# EAGLE board panel (EAGLE 8.7.0), part 1 of 2
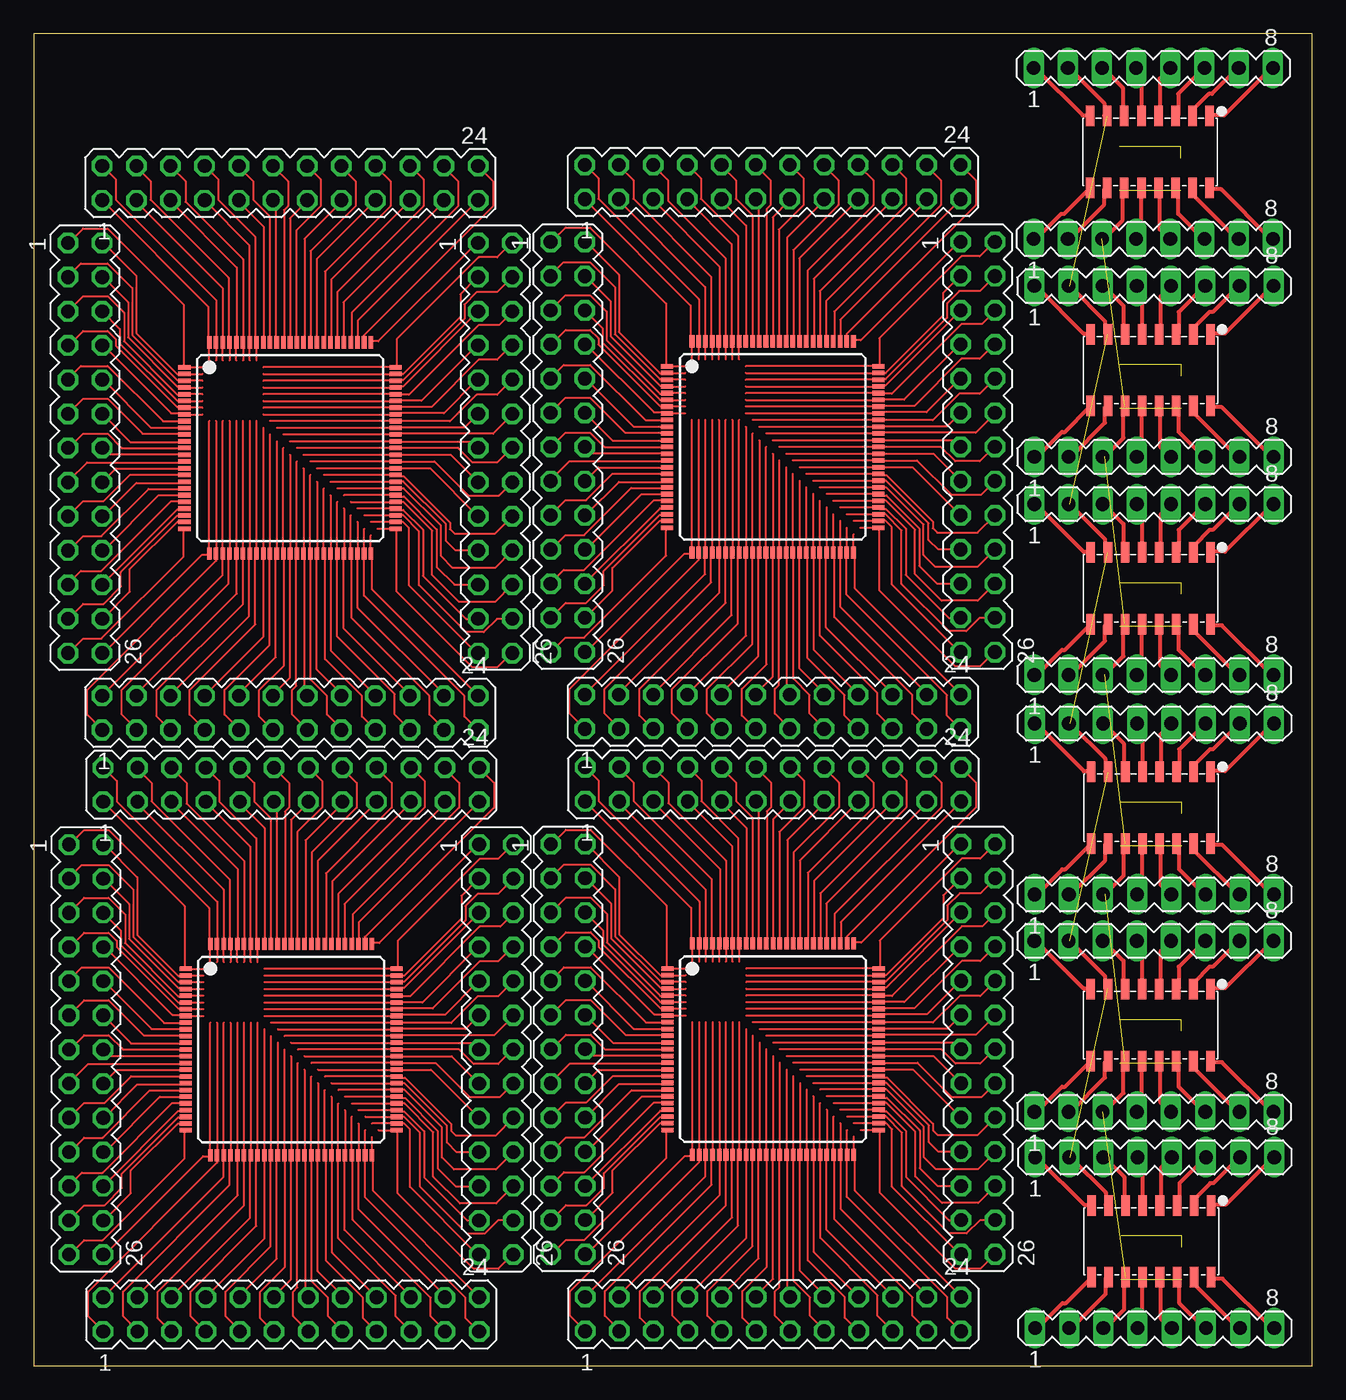
[diagram p5: board, top side]
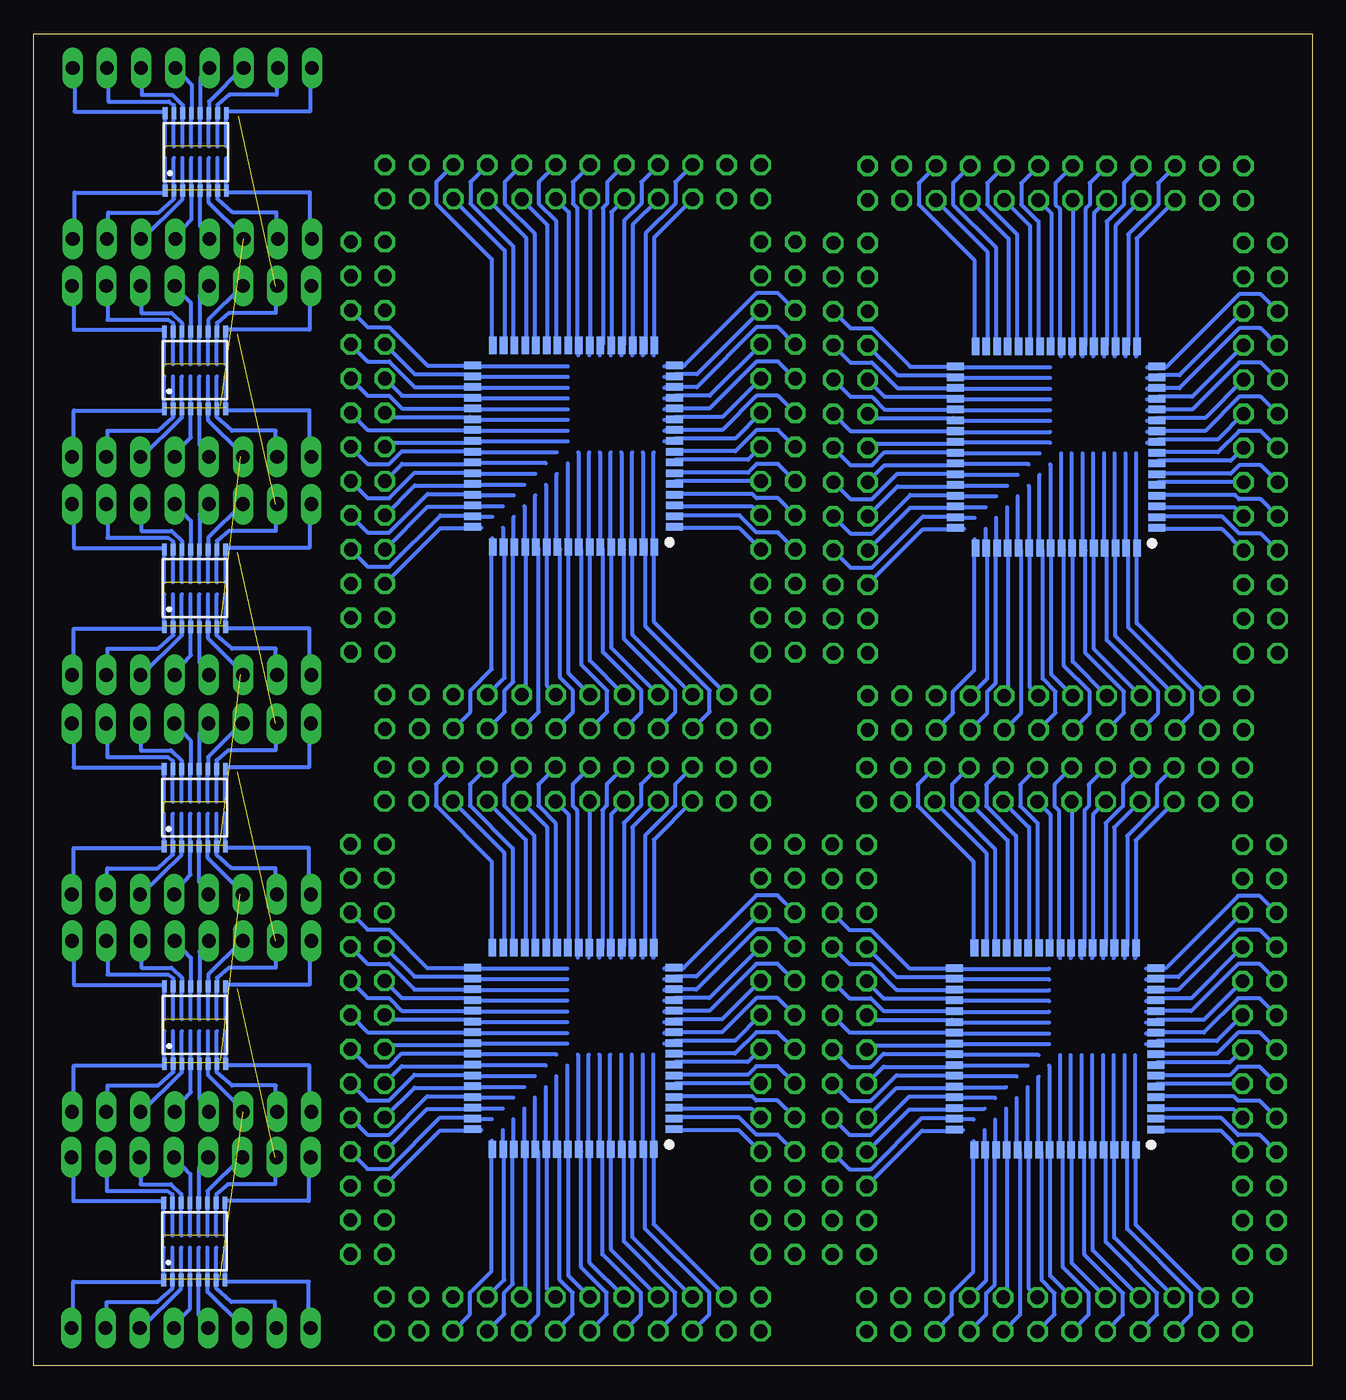
[diagram p6: board, bottom side, seen from below]

Size 95 x 99 mm. Coordinates in mm from the lower left corner, seen from the top.
Outline: 0,0 95,0 95,99 0,99 0,0
Copper layers (1*16): Top 0.035mm / dielectric 1.5mm / Bottom 0.035mm
Design rules "default": minimum track width 6mil, minimum drill 0.35mm, track to track 6mil, track to pad 6mil, pad to pad 6mil, via to via 6mil, smd to smd 6mil, copper to edge 40mil, drill to drill 6mil, minimum pad ring 10mil, minimum via ring 8mil, stop-mask expansion 4mil, vias tented up to drill 0mil, thermal gap 10mil

## Footprints (pad centres in the part's own frame; a part is rotated, then mirrored left to right if it is on the bottom)
TQFP100-14X14 = smd 0.9 x 0.34: 1 -7.85,6; 2 -7.85,5.5; 3 -7.85,5; 4 -7.85,4.5; 5 -7.85,4; 6 -7.85,3.5; 7 -7.85,3; 8 -7.85,2.5; 9 -7.85,2; 10 -7.85,1.5; 11 -7.85,1; 12 -7.85,0.5; 13 -7.85,0; 14 -7.85,-0.5; 15 -7.85,-1; 16 -7.85,-1.5; 17 -7.85,-2; 18 -7.85,-2.5; 19 -7.85,-3; 20 -7.85,-3.5; 21 -7.85,-4; 22 -7.85,-4.5; 23 -7.85,-5; 24 -7.85,-5.5; 25 -7.85,-6; 51 7.85,-6; 52 7.85,-5.5; 53 7.85,-5; 54 7.85,-4.5; 55 7.85,-4; 56 7.85,-3.5; 57 7.85,-3; 58 7.85,-2.5; 59 7.85,-2; 60 7.85,-1.5; 61 7.85,-1; 62 7.85,-0.5; 63 7.85,0; 64 7.85,0.5; 65 7.85,1; 66 7.85,1.5; 67 7.85,2; 68 7.85,2.5; 69 7.85,3; 70 7.85,3.5; 71 7.85,4; 72 7.85,4.5; 73 7.85,5; 74 7.85,5.5; 75 7.85,6 | smd 0.34 x 0.9: 26 -6,-7.85; 27 -5.5,-7.85; 28 -5,-7.85; 29 -4.5,-7.85; 30 -4,-7.85; 31 -3.5,-7.85; 32 -3,-7.85; 33 -2.5,-7.85; 34 -2,-7.85; 35 -1.5,-7.85; 36 -1,-7.85; 37 -0.5,-7.85; 38 0,-7.85; 39 0.5,-7.85; 40 1,-7.85; 41 1.5,-7.85; 42 2,-7.85; 43 2.5,-7.85; 44 3,-7.85; 45 3.5,-7.85; 46 4,-7.85; 47 4.5,-7.85; 48 5,-7.85; 49 5.5,-7.85; 50 6,-7.85; 76 6,7.85; 77 5.5,7.85; 78 5,7.85; 79 4.5,7.85; 80 4,7.85; 81 3.5,7.85; 82 3,7.85; 83 2.5,7.85; 84 2,7.85; 85 1.5,7.85; 86 1,7.85; 87 0.5,7.85; 88 0,7.85; 89 -0.5,7.85; 90 -1,7.85; 91 -1.5,7.85; 92 -2,7.85; 93 -2.5,7.85; 94 -3,7.85; 95 -3.5,7.85; 96 -4,7.85; 97 -4.5,7.85; 98 -5,7.85; 99 -5.5,7.85; 100 -6,7.85
MA13-2 = drill 1.016 octagon: 1 -15.24,-1.27; 2 -15.24,1.27; 3 -12.7,-1.27; 4 -12.7,1.27; 5 -10.16,-1.27; 6 -10.16,1.27; 7 -7.62,-1.27; 8 -7.62,1.27; 9 -5.08,-1.27; 10 -5.08,1.27; 11 -2.54,-1.27; 12 -2.54,1.27; 13 0,-1.27; 14 0,1.27; 15 2.54,-1.27; 16 2.54,1.27; 17 5.08,-1.27; 18 5.08,1.27; 19 7.62,-1.27; 20 7.62,1.27; 21 10.16,-1.27; 22 10.16,1.27; 23 12.7,-1.27; 24 12.7,1.27; 25 15.24,-1.27; 26 15.24,1.27
MA12-2 = drill 1.016 octagon: 1 -13.97,-1.27; 2 -13.97,1.27; 3 -11.43,-1.27; 4 -11.43,1.27; 5 -8.89,-1.27; 6 -8.89,1.27; 7 -6.35,-1.27; 8 -6.35,1.27; 9 -3.81,-1.27; 10 -3.81,1.27; 11 -1.27,-1.27; 12 -1.27,1.27; 13 1.27,-1.27; 14 1.27,1.27; 15 3.81,-1.27; 16 3.81,1.27; 17 6.35,-1.27; 18 6.35,1.27; 19 8.89,-1.27; 20 8.89,1.27; 21 11.43,-1.27; 22 11.43,1.27; 23 13.97,-1.27; 24 13.97,1.27
MA08-1 = drill 1.016 long: 1 -8.89,0; 2 -6.35,0; 3 -3.81,0; 4 -1.27,0; 5 1.27,0; 6 3.81,0; 7 6.35,0; 8 8.89,0
SOP16-1.27-10.0X5.0MM = smd 0.635 x 1.524: 1 -4.445,-2.667; 2 -3.175,-2.667; 3 -1.905,-2.667; 4 -0.635,-2.667; 5 0.635,-2.667; 6 1.905,-2.667; 7 3.175,-2.667; 8 4.445,-2.667; 9 4.445,2.667; 10 3.175,2.667; 11 1.905,2.667; 12 0.635,2.667; 13 -0.635,2.667; 14 -1.905,2.667; 15 -3.175,2.667; 16 -4.445,2.667
TQFP64-0.8 = smd 1.27 x 0.559: 1 -4.293,2.8; 2 -4.293,2; 3 -4.293,1.2; 4 -4.293,0.4; 5 -4.293,-0.4; 6 -4.293,-1.2; 7 -4.293,-2; 8 -4.293,-2.8; 9 -4.293,-3.6; 10 -4.293,-4.4; 11 -4.293,-5.2; 12 -4.293,-6; 13 -4.293,-6.8; 14 -4.293,-7.6; 15 -4.293,-8.4; 16 -4.293,-9.2; 33 10.693,-9.2; 34 10.693,-8.4; 35 10.693,-7.6; 36 10.693,-6.8; 37 10.693,-6; 38 10.693,-5.2; 39 10.693,-4.4; 40 10.693,-3.6; 41 10.693,-2.8; 42 10.693,-2; 43 10.693,-1.2; 44 10.693,-0.4; 45 10.693,0.4; 46 10.693,1.2; 47 10.693,2; 48 10.693,2.8 | smd 0.559 x 1.27: 17 -2.8,-10.693; 18 -2,-10.693; 19 -1.2,-10.693; 20 -0.4,-10.693; 21 0.4,-10.693; 22 1.2,-10.693; 23 2,-10.693; 24 2.8,-10.693; 25 3.6,-10.693; 26 4.4,-10.693; 27 5.2,-10.693; 28 6,-10.693; 29 6.8,-10.693; 30 7.6,-10.693; 31 8.4,-10.693; 32 9.2,-10.693; 49 9.2,4.293; 50 8.4,4.293; 51 7.6,4.293; 52 6.8,4.293; 53 6,4.293; 54 5.2,4.293; 55 4.4,4.293; 56 3.6,4.293; 57 2.8,4.293; 58 2,4.293; 59 1.2,4.293; 60 0.4,4.293; 61 -0.4,4.293; 62 -1.2,4.293; 63 -2,4.293; 64 -2.8,4.293
TSSOP16 = smd 0.9 x 0.35: 1 -2.875,2.275; 2 -2.875,1.625; 3 -2.875,0.975; 4 -2.875,0.325; 5 -2.875,-0.325; 6 -2.875,-0.975; 7 -2.875,-1.625; 8 -2.875,-2.275; 9 2.875,-2.275; 10 2.875,-1.625; 11 2.875,-0.975; 12 2.875,-0.325; 13 2.875,0.325; 14 2.875,0.975; 15 2.875,1.625; 16 2.875,2.275

## Placement (x,y rotation side)
IC2  [TQFP100-14X14]  19.14,23.5 0 top
IC3  [TQFP100-14X14]  54.92,68.28 0 top
IC4  [TQFP100-14X14]  54.95,23.53 0 top
IC6  [TQFP100-14X14]  19.06,68.21 0 top
JP5  [MA13-2]  3.9,23.5 270 top
JP6  [MA13-2]  34.38,23.5 270 top
JP7  [MA12-2]  19.14,43.19 0 top
JP8  [MA12-2]  19.14,3.82 0 top
JP9  [MA13-2]  39.68,68.28 270 top
JP10  [MA13-2]  70.16,68.28 270 top
JP11  [MA12-2]  54.92,87.97 0 top
JP12  [MA12-2]  54.92,48.6 0 top
JP13  [MA13-2]  39.71,23.53 270 top
JP14  [MA13-2]  70.19,23.53 270 top
JP15  [MA12-2]  54.95,43.21 0 top
JP16  [MA12-2]  54.95,3.84 0 top
JP21  [MA13-2]  3.82,68.21 270 top
JP22  [MA13-2]  34.3,68.21 270 top
JP23  [MA12-2]  19.06,87.89 0 top
JP24  [MA12-2]  19.06,48.52 0 top
SV3  [MA08-1]  83.31,15.5 0 top
SV4  [MA08-1]  83.31,2.8 0 top
SV7  [MA08-1]  83.25,31.58 0 top
SV8  [MA08-1]  83.25,18.88 0 top
SV11  [MA08-1]  83.28,47.73 0 top
SV12  [MA08-1]  83.28,35.03 0 top
SV15  [MA08-1]  83.25,64.04 0 top
SV16  [MA08-1]  83.25,51.34 0 top
SV19  [MA08-1]  83.25,80.24 0 top
SV20  [MA08-1]  83.25,67.55 0 top
SV23  [MA08-1]  83.2,96.45 0 top
SV24  [MA08-1]  83.2,83.75 0 top
U2  TM2291  [SOP16-1.27-10.0X5.0MM]  83.06,9.25 180 top
U4  TM2291  [SOP16-1.27-10.0X5.0MM]  83,25.33 180 top
U6  TM2291  [SOP16-1.27-10.0X5.0MM]  83.03,41.48 180 top
U8  TM2291  [SOP16-1.27-10.0X5.0MM]  83,57.79 180 top
U10  TM2291  [SOP16-1.27-10.0X5.0MM]  83,73.99 180 top
U12  TM2291  [SOP16-1.27-10.0X5.0MM]  82.95,90.2 180 top
U$2  TQFP64  [TQFP64-0.8]  15.89,20.36 180 bottom
U$3  TQFP64  [TQFP64-0.8]  51.68,65.14 180 bottom
U$4  TQFP64  [TQFP64-0.8]  51.7,20.39 180 bottom
U$6  TQFP64  [TQFP64-0.8]  15.81,65.06 180 bottom
U$7  SSOP16  [TSSOP16]  83.06,9.25 90 bottom
U$9  SSOP16  [TSSOP16]  83,25.33 90 bottom
U$11  SSOP16  [TSSOP16]  83.03,41.48 90 bottom
U$13  SSOP16  [TSSOP16]  83,57.79 90 bottom
U$15  SSOP16  [TSSOP16]  83,73.99 90 bottom
U$17  SSOP16  [TSSOP16]  82.95,90.2 90 bottom

## Tracks (layer width: path | path; a pad name or v marks a point on that pad's centre or on a via)
N$208
  Top 0.152: IC2.1 11.21,29.6 11.21,34.17 5.57,39.81 3.74,39.81 2.68,38.74 JP5.1
N$209
  Top 0.152: IC2.2 11.21,28.99 10.75,28.99 7.71,32.04 7.71,36.31 5.27,38.74 JP5.2
N$210
  Top 0.152: IC2.3 11.21,28.53 10.75,28.53 7.4,31.89 7.4,35.39 5.57,37.22 3.59,37.22 2.68,36.31 JP5.3
N$211
  Top 0.152: IC2.4 11.21,28.08 10.75,28.08 7.1,31.73 7.1,34.33 5.27,36.15 JP5.4
N$212
  Top 0.152: JP5.5 3.74,34.78 5.57,34.78 6.79,33.56 6.79,31.43 10.75,27.47 11.21,27.47 IC2.5
  Bottom 0.305: JP5.5 3.9,34.93 5.48,34.93 10.88,29.54 11.52,29.54 U$2.16
N$213
  Top 0.152: JP5.6 6.49,32.34 6.49,31.28 10.75,27.01 11.21,27.01 IC2.6
  Bottom 0.305: JP5.6 9.93,28.9 11.52,28.9 U$2.15
N$214
  Top 0.152: IC2.7 11.21,26.55 10.75,26.55 6.18,31.12 6.18,31.58 5.57,32.19 3.74,32.19 2.68,31.12 JP5.7
  Bottom 0.305: JP5.7 3.9,32.39 5.48,32.39 9.93,27.95 11.52,27.95 U$2.14
N$215
  Top 0.152: IC2.8 11.21,26.09 10.3,26.09 5.27,31.12 JP5.8
  Bottom 0.305: JP5.8 8.98,27.31 11.52,27.31 U$2.13
N$216
  Top 0.152: IC2.9 11.21,25.49 9.69,25.49 5.57,29.6 3.59,29.6 2.68,28.69 JP5.9
  Bottom 0.305: JP5.9 3.9,29.85 5.48,29.85 8.98,26.36 11.52,26.36 U$2.12
N$217
  Top 0.152: IC2.10 11.21,25.03 8.77,25.03 5.27,28.53 JP5.10
  Bottom 0.305: JP5.10 8.02,25.73 11.52,25.73 U$2.11
N$218
  Top 0.152: JP5.11 3.74,27.16 5.57,27.16 8.16,24.57 11.21,24.57 IC2.11
  Bottom 0.305: JP5.11 3.9,27.31 5.48,27.31 8.02,24.77 11.52,24.77 U$2.10
N$219
  Top 0.152: JP5.12 7.25,23.96 11.21,23.96 IC2.12
  Bottom 0.305: JP5.12 7.07,24.14 11.52,24.14 U$2.9
N$220
  Top 0.152: IC2.13 6.64,23.5 5.57,24.57 3.74,24.57 2.68,23.5 JP5.13
  Bottom 0.305: JP5.13 3.9,24.77 5.48,24.77 7.07,23.19 11.52,23.19 U$2.8
N$221
  Top 0.152: IC2.25 11.21,17.41 11.21,15.43 5.12,9.33 3.74,9.33 2.68,8.26 JP5.25
N$222
  Top 0.152: IC2.24 11.21,18.02 10.75,18.02 7.22,14.51 7.22,12.84 5.27,10.86 JP5.24
N$223
  Top 0.152: JP5.23 3.74,11.92 5.27,11.92 6.56,13.22 6.56,14.28 10.75,18.48 11.21,18.48 IC2.23
N$224
  Top 0.152: JP5.22 10.75,18.93 11.21,18.93 IC2.22
N$225
  Top 0.152: IC2.21 11.21,19.54 10.3,19.54 5.12,14.36 3.59,14.36 2.68,13.45 JP5.21
N$226
  Top 0.152: IC2.20 11.21,20 9.38,20 5.27,15.88 JP5.20
  Bottom 0.305: JP5.20 6.75,17.47 11.52,17.47 U$2.1
N$227
  Top 0.152: IC2.19 11.21,20.46 8.62,20.46 5.12,16.95 3.74,16.95 2.68,15.88 JP5.19
  Bottom 0.305: JP5.19 3.9,17.15 5.48,17.15 6.75,18.42 11.52,18.42 U$2.2
N$228
  Top 0.152: IC2.18 11.21,20.91 7.71,20.91 5.27,18.48 JP5.18
  Bottom 0.305: JP5.18 5.8,19.06 11.52,19.06 U$2.3
N$229
  Top 0.152: JP5.17 3.74,19.54 5.27,19.54 7.25,21.52 11.21,21.52 IC2.17
  Bottom 0.305: JP5.17 3.9,19.69 5.48,19.69 5.8,20.01 11.52,20.01 U$2.4
N$230
  Top 0.152: JP5.16 6.18,21.98 11.21,21.98 IC2.16
  Bottom 0.305: JP5.16 11.52,20.96 U$2.5
N$231
  Top 0.152: IC2.15 11.21,22.44 4.05,22.44 2.68,21.07 JP5.15
  Bottom 0.305: JP5.15 3.9,22.23 5.48,22.23 6.12,21.6 11.52,21.6 U$2.6
N$232
  Top 0.152: IC2.14 11.21,23.05 5.72,23.05 5.27,23.5 JP5.14
  Bottom 0.305: JP5.14 6.12,22.55 11.52,22.55 U$2.7
N$233
  Top 0.152: IC2.27 13.65,15.58 13.65,15.12 4.05,5.52 4.05,3.69 5.12,2.63 JP8.1
N$234
  Top 0.152: IC2.28 14.11,15.58 14.11,14.06 5.27,5.22 JP8.2
N$235
  Top 0.152: IC2.29 14.56,15.58 14.56,13.45 6.64,5.52 6.64,3.69 7.71,2.63 JP8.3
N$236
  Top 0.152: IC2.30 15.17,15.58 15.17,12.68 7.71,5.22 JP8.4
  Bottom 0.305: JP8.4 13.1,10.49 13.1,15.88 U$2.64
N$237
  Top 0.152: IC2.31 15.63,15.58 15.63,11.92 9.23,5.52 9.23,3.54 10.14,2.63 JP8.5
  Bottom 0.305: JP8.5 8.98,3.82 8.98,5.41 13.74,10.17 13.74,15.88 U$2.63
N$238
  Top 0.152: IC2.32 16.09,15.58 16.09,11.01 10.3,5.22 JP8.6
  Bottom 0.305: JP8.6 14.69,9.53 14.69,15.88 U$2.62
N$239
  Top 0.152: IC2.33 16.55,15.58 16.55,10.4 11.67,5.52 11.67,3.69 12.73,2.63 JP8.7
  Bottom 0.305: JP8.7 11.52,3.82 11.52,5.41 15.33,9.22 15.33,15.88 U$2.61
N$240
  Top 0.152: IC2.34 17.15,15.58 17.15,9.48 12.89,5.22 JP8.8
  Bottom 0.305: JP8.8 16.28,8.58 16.28,15.88 U$2.60
N$241
  Top 0.152: IC2.35 17.61,15.58 17.61,8.87 14.26,5.52 14.26,3.69 15.33,2.63 JP8.9
  Bottom 0.305: JP8.9 14.06,3.82 14.06,5.41 16.91,8.26 16.91,15.88 U$2.59
N$242
  Top 0.152: IC2.36 18.07,15.58 18.07,7.96 15.33,5.22 JP8.10
  Bottom 0.305: JP8.10 17.87,7.63 17.87,15.88 U$2.58
N$243
  Top 0.152: IC2.37 18.68,15.58 18.68,7.35 16.85,5.52 16.85,3.54 17.76,2.63 JP8.11
  Bottom 0.305: JP8.11 16.6,3.82 16.6,5.41 18.5,7.31 18.5,15.88 U$2.57
N$244
  Top 0.152: IC2.38 19.14,6.44 17.92,5.22 JP8.12
  Bottom 0.305: JP8.12 19.45,6.68 19.45,15.88 U$2.56
N$245
  Top 0.152: IC2.50 25.23,15.58 25.23,12.99 33,5.22 JP8.24
N$246
  Top 0.152: IC2.49 24.62,15.58 24.62,12.53 32.09,5.06 32.09,3.54 33,2.63 JP8.23
N$247
  Top 0.152: IC2.48 24.16,15.58 24.16,11.62 30.57,5.22 JP8.22
N$248
  Top 0.152: IC2.47 23.71,15.58 23.71,10.86 29.5,5.06 29.5,3.69 30.57,2.63 JP8.21
N$249
  Top 0.152: IC2.46 23.1,15.58 23.1,10.09 27.98,5.22 JP8.20
N$250
  Top 0.152: IC2.45 22.64,15.58 22.64,9.48 26.91,5.22 26.91,3.69 27.98,2.63 JP8.19
  Bottom 0.305: JP8.19 26.76,3.82 26.76,5.41 25.17,6.99 25.17,15.88 U$2.49
N$251
  Top 0.152: IC2.44 22.18,15.58 22.18,8.42 25.38,5.22 JP8.18
  Bottom 0.305: JP8.18 24.22,6.36 24.22,15.88 U$2.50
N$252
  Top 0.152: IC2.43 21.73,15.58 21.73,7.81 24.47,5.06 24.47,3.54 25.38,2.63 JP8.17
  Bottom 0.305: JP8.17 24.22,3.82 24.22,5.41 23.58,6.04 23.58,15.88 U$2.51
N$253
  Top 0.152: IC2.42 21.12,15.58 21.12,7.04 22.95,5.22 JP8.16
  Bottom 0.305: JP8.16 22.63,5.41 22.63,15.88 U$2.52
N$254
  Top 0.152: IC2.41 20.66,15.58 20.66,6.28 21.88,5.06 21.88,3.69 22.95,2.63 JP8.15
  Bottom 0.305: JP8.15 21.68,3.82 21.68,15.88 U$2.53
N$255
  Top 0.152: IC2.40 20.2,15.58 20.2,5.37 20.36,5.22 JP8.14
  Bottom 0.305: JP8.14 21.04,5.72 21.04,15.88 U$2.54
N$256
  Top 0.152: IC2.39 19.59,15.58 19.59,5.83 19.29,5.52 19.29,3.69 20.36,2.63 JP8.13
  Bottom 0.305: JP8.13 19.14,3.82 19.14,5.41 20.09,6.36 20.09,15.88 U$2.55
N$257
  Top 0.152: JP6.14 35.59,23.5 34.53,22.44 32.7,22.44 31.63,23.5 IC2.63 19.64,23.5
  Bottom 0.305: JP6.14 34.38,22.23 32.79,22.23 31.84,23.19 26.76,23.19 U$2.41
N$258
  Top 0.152: IC2.62 31.07,23 JP6.15
  Bottom 0.305: JP6.15 31.84,22.23 26.76,22.23 U$2.42
N$259
  Top 0.152: JP6.16 34.66,19.97 32.39,19.97 29.86,22.5 IC2.61 20.64,22.5
  Bottom 0.305: JP6.16 34.38,19.69 32.79,19.69 30.88,21.6 26.76,21.6 U$2.43
N$260
  Top 0.152: JP6.17 29.53,22 IC2.60 21.14,22
  Bottom 0.305: JP6.17 30.88,20.65 26.76,20.65 U$2.44
N$261
  Top 0.152: IC2.59 27.09,21.4 27.59,21.4 31.02,17.97 31.02,17.47 31.36,17.13 34.35,17.13 JP6.18
  Bottom 0.305: JP6.18 34.38,17.15 32.79,17.15 29.93,20.01 26.76,20.01 U$2.45
N$262
  Top 0.152: JP6.19 31.43,15.88 30.72,16.6 30.72,17.84 27.54,21.02 27.53,21 IC2.58 22.14,21
  Bottom 0.305: JP6.19 29.93,19.06 26.76,19.06 U$2.46
N$263
  Top 0.152: JP6.20 34.35,14.59 31.23,14.59 30.34,15.48 30.34,17.74 27.57,20.5 IC2.57 22.64,20.5
  Bottom 0.305: JP6.20 34.38,14.61 32.79,14.61 28.98,18.42 26.76,18.42 U$2.47
N$264
  Top 0.152: IC2.56 27.09,19.9 27.59,19.9 30.03,17.46 30.03,14.66 31.35,13.34 JP6.21
  Bottom 0.305: JP6.21 28.98,17.47 26.76,17.47 U$2.48
N$265
  Top 0.152: JP6.22 34.38,12.07 31.68,12.07 29.7,14.06 29.7,17.36 27.55,19.5 IC2.55 23.64,19.5
N$266
  Top 0.152: IC2.54 27.09,18.9 27.55,18.9 29.02,17.43 29.02,14.01 32.22,10.8 JP6.23
N$267
  Top 0.152: JP6.24 34.51,10.8 33.52,9.81 32.22,9.81 28.71,13.32 28.71,17.31 27.51,18.5 IC2.53 24.64,18.5
N$268
  Top 0.152: IC2.52 27.06,18.02 27.52,18.02 27.98,17.56 27.98,13.29 33,8.26 JP6.25
N$269
  Top 0.152: IC2.51 27.06,17.41 27.06,12.84 32.7,7.2 34.53,7.2 35.59,8.26 JP6.26
N$270
  Top 0.152: IC2.64 27.06,23.96 32.55,23.96 33,23.5 JP6.13
  Bottom 0.305: JP6.13 32.79,23.82 26.76,23.82 U$2.40
N$271
  Top 0.152: IC2.65 27.06,24.57 34.22,24.57 35.59,25.94 JP6.12
  Bottom 0.305: JP6.12 34.38,24.77 26.76,24.77 U$2.39
N$272
  Top 0.152: JP6.11 32.09,25.03 27.06,25.03 IC2.66
  Bottom 0.305: JP6.11 32.79,25.73 26.76,25.73 U$2.38
N$273
  Top 0.152: JP6.10 34.53,27.47 33,27.47 31.02,25.49 27.06,25.49 IC2.67
  Bottom 0.305: JP6.10 34.38,27.31 32.79,27.31 31.84,26.36 26.76,26.36 U$2.37
N$274
  Top 0.152: IC2.68 27.06,26.09 30.57,26.09 33,28.53 JP6.9
  Bottom 0.305: JP6.9 31.84,27.31 26.76,27.31 U$2.36
N$275
  Top 0.152: IC2.69 27.06,26.55 29.65,26.55 33.16,30.06 34.53,30.06 35.59,31.12 JP6.8
  Bottom 0.305: JP6.8 34.38,29.85 32.79,29.85 30.88,27.95 26.76,27.95 U$2.35
N$276
  Top 0.152: IC2.70 27.06,27.01 28.89,27.01 33,31.12 JP6.7
  Bottom 0.305: JP6.7 30.88,28.9 26.76,28.9 U$2.34
N$277
  Top 0.152: IC2.71 27.06,27.47 27.98,27.47 33.16,32.65 34.68,32.65 35.59,33.56 JP6.6
  Bottom 0.305: JP6.6 34.38,32.39 32.79,32.39 29.93,29.54 26.76,29.54 U$2.33
N$278
  Top 0.152: JP6.5 27.52,28.08 27.06,28.08 IC2.72
N$279
  Top 0.152: JP6.4 34.53,35.09 33,35.09 32.09,34.17 32.09,33.11 27.52,28.53 27.06,28.53 IC2.73
N$280
  Top 0.152: IC2.74 27.06,28.99 27.52,28.99 31.79,33.26 31.79,34.93 33,36.15 JP6.3
N$281
  Top 0.152: IC2.75 27.06,29.6 27.06,31.58 33.16,37.68 34.53,37.68 35.59,38.74 JP6.2
N$282
  Top 0.152: IC2.100 13.04,31.43 13.04,34.02 5.27,41.79 JP7.1
N$283
  Top 0.152: IC2.99 13.65,31.43 13.65,34.48 6.18,41.95 6.18,43.47 5.27,44.38 JP7.2
N$284
  Top 0.152: IC2.98 14.11,31.43 14.11,35.39 7.71,41.79 JP7.3
N$285
  Top 0.152: IC2.97 14.56,31.43 14.56,36.15 8.77,41.95 8.77,43.32 7.71,44.38 JP7.4
N$286
  Top 0.152: IC2.96 15.17,31.43 15.17,36.92 10.3,41.79 JP7.5
  Bottom 0.305: JP7.5 13.1,39.06 13.1,31.12 U$2.17
N$287
  Top 0.152: IC2.95 15.63,31.43 15.63,37.52 11.36,41.79 11.36,43.32 10.3,44.38 JP7.6
  Bottom 0.305: JP7.6 11.52,43.19 11.52,41.6 13.74,39.38 13.74,31.12 U$2.18
N$288
  Top 0.152: IC2.94 16.09,31.43 16.09,38.59 12.89,41.79 JP7.7
  Bottom 0.305: JP7.7 14.69,40.01 14.69,31.12 U$2.19
N$289
  Top 0.152: IC2.93 16.55,31.43 16.55,39.2 13.8,41.95 13.8,43.47 12.89,44.38 JP7.8
  Bottom 0.305: JP7.8 14.06,43.19 14.06,41.6 15.33,40.33 15.33,31.12 U$2.20
N$290
  Top 0.152: IC2.92 17.15,31.43 17.15,39.96 15.33,41.79 JP7.9
  Bottom 0.305: JP7.9 16.28,40.97 16.28,31.12 U$2.21
N$291
  Top 0.152: IC2.91 17.61,31.43 17.61,40.73 16.39,41.95 16.39,43.32 15.33,44.38 JP7.10
  Bottom 0.305: JP7.10 16.6,43.19 16.6,41.6 16.91,41.28 16.91,31.12 U$2.22
N$292
  Top 0.152: IC2.90 18.07,31.43 18.07,41.64 17.92,41.79 JP7.11
  Bottom 0.305: JP7.11 17.87,31.12 U$2.23
N$293
  Top 0.152: IC2.89 18.68,31.43 18.68,41.18 18.98,41.49 18.98,43.32 17.92,44.38 JP7.12
  Bottom 0.305: JP7.12 19.14,43.19 19.14,41.6 18.82,41.28 18.82,31.12 U$2.24
N$294
  Top 0.152: IC2.77 24.62,31.43 24.62,31.89 34.22,41.49 34.22,43.32 33.16,44.38 JP7.24
N$295
  Top 0.152: IC2.78 24.16,31.43 24.16,32.95 33,41.79 JP7.23
N$296
  Top 0.152: IC2.79 23.71,31.43 23.71,33.56 31.63,41.49 31.63,43.32 30.57,44.38 JP7.22
N$297
  Top 0.152: IC2.80 23.1,31.43 23.1,34.33 30.57,41.79 JP7.21
N$298
  Top 0.152: IC2.81 22.64,31.43 22.64,35.09 29.04,41.49 29.04,43.47 28.13,44.38 JP7.20
  Bottom 0.305: JP7.20 29.3,43.19 29.3,41.6 25.17,37.47 25.17,31.12 U$2.32
N$299
  Top 0.152: IC2.82 22.18,31.43 22.18,36 27.98,41.79 JP7.19
  Bottom 0.305: JP7.19 24.22,38.11 24.22,31.12 U$2.31
N$300
  Top 0.152: IC2.83 21.73,31.43 21.73,36.61 26.6,41.49 26.6,43.32 25.54,44.38 JP7.18
  Bottom 0.305: JP7.18 26.76,43.19 26.76,41.6 23.58,38.43 23.58,31.12 U$2.30
N$301
  Top 0.152: IC2.84 21.12,31.43 21.12,37.52 25.38,41.79 JP7.17
  Bottom 0.305: JP7.17 22.63,39.06 22.63,31.12 U$2.29
N$302
  Top 0.152: IC2.85 20.66,31.43 20.66,38.13 24.01,41.49 24.01,43.32 22.95,44.38 JP7.16
  Bottom 0.305: JP7.16 24.22,43.19 24.22,41.6 21.99,39.38 21.99,31.12 U$2.28
N$303
  Top 0.152: IC2.86 20.2,31.43 20.2,39.05 22.95,41.79 JP7.15
  Bottom 0.305: JP7.15 21.04,40.01 21.04,31.12 U$2.27
N$304
  Top 0.152: IC2.87 19.59,31.43 19.59,39.66 21.42,41.49 21.42,43.47 20.51,44.38 JP7.14
  Bottom 0.305: JP7.14 21.68,43.19 21.68,41.6 20.41,40.33 20.41,31.12 U$2.26
N$305
  Top 0.152: IC2.88 19.14,40.57 20.36,41.79 JP7.13
  Bottom 0.305: JP7.13 19.45,40.97 19.45,31.12 U$2.25
N$306
  Top 0.152: IC2.76 25.23,31.43 25.69,31.43 33,38.74 JP6.1
N$307
  Top 0.152: IC2.26 13.04,15.58 12.58,15.58 5.27,8.26 JP5.26
N$308
  Top 0.152: 13.14,16 13.14,25.5
N$309
  Top 0.152: 13.64,25.5 13.64,16
N$310
  Top 0.152: 14.14,16 14.14,25.5
N$311
  Top 0.152: 14.64,25.5 14.64,16
N$312
  Top 0.152: 15.14,25.5 15.14,16
N$313
  Top 0.152: 15.64,16 15.64,25.5
N$314
  Top 0.152: 16.14,25.5 16.14,16
N$315
  Top 0.152: 16.64,16 16.64,25.5
N$316
  Top 0.152: 27.14,29.5 17.14,29.5
N$317
  Top 0.152: 17.14,29 26.64,29
N$318
  Top 0.152: 26.64,28.5 17.14,28.5
N$319
  Top 0.152: 17.14,28 26.64,28
N$320
  Top 0.152: 26.64,27.5 17.14,27.5
N$321
  Top 0.152: 17.14,27 26.64,27
N$322
  Top 0.152: 26.64,26.5 17.14,26.5
N$323
  Top 0.152: 17.14,26 26.64,26
N$324
  Top 0.152: 17.14,25 17.14,15.5
N$325
  Top 0.152: 17.64,15.5 17.64,24.5
N$326
  Top 0.152: 18.14,24 18.14,16
N$327
  Top 0.152: 18.64,16 18.64,23.5
N$328
  Top 0.152: 19.14,23 19.14,16
N$329
  Top 0.152: 19.64,16 19.64,22.5
N$330
  Top 0.152: 20.14,22 20.14,16
N$331
  Top 0.152: 20.64,16 20.64,21.5
N$332
  Top 0.152: 21.14,21 21.14,16
N$333
  Top 0.152: 21.64,16 21.64,20.5
N$334
  Top 0.152: 22.14,20 22.14,15.5
N$335
  Top 0.152: 22.64,15.5 22.64,19.5
N$336
  Top 0.152: 23.14,19 23.14,16
N$337
  Top 0.152: 23.64,16 23.64,18.5
N$338
  Top 0.152: 24.14,18 24.14,16
N$339
  Top 0.152: 24.64,16 24.64,17.5
N$340
  Top 0.152: 25.14,15.5 25.14,17
N$341
  Top 0.152: 26.64,25.5 17.64,25.5
N$342
  Top 0.152: 18.14,25 27.14,25
N$343
  Top 0.152: 27.14,24.5 18.64,24.5
N$344
  Top 0.152: 19.14,24 27.14,24
N$345
  Top 0.152: 20.14,23 26.64,23
N$346
  Top 0.152: 27.14,21.5 21.64,21.5
N$347
  Top 0.152: 27.14,20 23.14,20
N$348
  Top 0.152: 27.14,19 24.14,19
N$349
  Top 0.152: 27.14,18 25.14,18
N$350
  Top 0.152: 25.64,17.5 27.14,17.5
N$351
  Top 0.152: 11.14,29.5 12.64,29.5
N$352
  Top 0.152: 11.14,29 12.64,29
N$353
  Top 0.152: 12.64,28.5 11.14,28.5
N$354
  Top 0.152: 11.14,28 12.64,28
N$355
  Top 0.152: 12.64,27.5 11.14,27.5
N$356
  Top 0.152: 11.14,27 12.64,27
N$357
  Top 0.152: 12.64,26.5 11.14,26.5
N$358
  Top 0.152: 11.14,26 12.64,26
N$359
  Top 0.152: 16.64,30 16.64,31.5
N$360
  Top 0.152: 16.14,30 16.14,31.5
N$361
  Top 0.152: 15.64,31.5 15.64,30
N$362
  Top 0.152: 15.14,30 15.14,31.5
N$363
  Top 0.152: 14.64,31.5 14.64,30
N$364
  Top 0.152: 14.14,30 14.14,31.5
N$365
  Top 0.152: 13.64,31.5 13.64,30
N$366
  Top 0.152: 13.14,30 13.14,31.5
N$367
  Bottom 0.305: 13.14,15.9 13.14,23.1
N$368
  Bottom 0.305: 13.94,23.1 13.94,15.9
N$369
  Bottom 0.305: 14.74,16.3 14.74,23.1
N$370
  Bottom 0.305: 15.54,23.1 15.54,15.9
N$371
  Bottom 0.305: 16.34,15.9 16.34,23.1
N$372
  Bottom 0.305: 17.14,23.1 17.14,15.9
N$373
  Bottom 0.305: 17.94,16.3 17.94,23.1
N$374
  Bottom 0.305: 18.74,23.1 18.74,15.9
N$375
  Bottom 0.305: 19.54,22.3 19.54,15.9
N$376
  Bottom 0.305: 20.34,15.9 20.34,21.5
N$377
  Bottom 0.305: 21.14,20.7 21.14,15.9
N$378
  Bottom 0.305: 21.94,16.3 21.94,19.9
N$379
  Bottom 0.305: 22.74,19.1 22.74,15.9
N$380
  Bottom 0.305: 23.54,15.9 23.54,18.3
N$381
  Bottom 0.305: 24.34,17.5 24.34,16.3
N$382
  Bottom 0.305: 25.14,16.3 25.14,16.7
N$383
  Bottom 0.305: 26.74,29.5 19.54,29.5
N$384
  Bottom 0.305: 19.54,28.7 26.74,28.7
N$385
  Bottom 0.305: 26.74,27.9 19.54,27.9
N$386
  Bottom 0.305: 19.54,27.1 26.74,27.1
N$387
  Bottom 0.305: 26.74,26.3 19.54,26.3
N$388
  Bottom 0.305: 19.54,25.5 26.74,25.5
N$389
  Bottom 0.305: 26.74,24.7 19.54,24.7
N$390
  Bottom 0.305: 19.54,23.9 26.74,23.9
N$391
  Bottom 0.305: 20.34,23.1 26.74,23.1
N$392
  Bottom 0.305: 21.14,22.3 26.74,22.3
N$393
  Bottom 0.305: 21.94,21.5 26.34,21.5
N$394
  Bottom 0.305: 26.74,20.7 22.74,20.7
N$395
  Bottom 0.305: 23.54,19.9 26.74,19.9
N$396
  Bottom 0.305: 26.74,19.1 24.34,19.1
N$397
  Bottom 0.305: 25.14,18.3 26.74,18.3
N$398
  Bottom 0.305: 26.74,17.5 25.94,17.5
N$399
  Bottom 0.305: 11.54,23.9 12.34,23.9
N$400
  Bottom 0.305: 11.54,24.7 12.34,24.7
N$401
  Bottom 0.305: 11.54,25.5 12.34,25.5
N$402
  Bottom 0.305: 11.54,26.3 12.34,26.3
N$403
  Bottom 0.305: 11.54,27.1 12.34,27.1
N$404
  Bottom 0.305: 11.54,27.9 12.34,27.9
N$405
  Bottom 0.305: 11.54,28.7 12.34,28.7
N$406
  Bottom 0.305: 11.54,29.5 12.34,29.5
N$407
  Bottom 0.305: 13.14,31.1 13.14,30.3
N$408
  Bottom 0.305: 13.94,31.1 13.94,30.3
N$409
  Bottom 0.305: 14.74,31.1 14.74,30.3
N$410
  Bottom 0.305: 15.54,31.1 15.54,30.3
N$411
  Bottom 0.305: 16.34,30.7 16.34,30.3
N$412
  Bottom 0.305: 17.14,30.3 17.14,30.7
N$413
  Bottom 0.305: 17.94,31.1 17.94,30.3
N$414
  Bottom 0.305: 18.74,30.3 18.74,31.1
N$415
  Top 0.152: IC3.1 47,74.38 47,78.95 41.36,84.59 39.53,84.59 38.47,83.53 JP9.1
N$416
  Top 0.152: IC3.2 47,73.77 46.54,73.77 43.49,76.82 43.49,81.09 41.06,83.53 JP9.2
N$417
  Top 0.152: IC3.3 47,73.31 46.54,73.31 43.19,76.67 43.19,80.17 41.36,82 39.38,82 38.47,81.09 JP9.3
N$418
  Top 0.152: IC3.4 47,72.86 46.54,72.86 42.88,76.51 42.88,79.11 41.06,80.93 JP9.4
N$419
  Top 0.152: JP9.5 39.53,79.56 41.36,79.56 42.58,78.34 42.58,76.21 46.54,72.25 47,72.25 IC3.5
  Bottom 0.305: JP9.5 39.68,79.72 41.27,79.72 46.67,74.32 47.3,74.32 U$3.16
N$420
  Top 0.152: JP9.6 42.27,77.12 42.27,76.06 46.54,71.79 47,71.79 IC3.6
  Bottom 0.305: JP9.6 45.72,73.68 47.3,73.68 U$3.15
N$421
  Top 0.152: IC3.7 47,71.33 46.54,71.33 41.97,75.91 41.97,76.36 41.36,76.97 39.53,76.97 38.47,75.91 JP9.7
  Bottom 0.305: JP9.7 39.68,77.17 41.27,77.17 45.72,72.73 47.3,72.73 U$3.14
N$422
  Top 0.152: IC3.8 47,70.88 46.09,70.88 41.06,75.91 JP9.8
  Bottom 0.305: JP9.8 44.76,72.09 47.3,72.09 U$3.13
N$423
  Top 0.152: IC3.9 47,70.27 45.48,70.27 41.36,74.38 39.38,74.38 38.47,73.47 JP9.9
  Bottom 0.305: JP9.9 39.68,74.64 41.27,74.64 44.76,71.14 47.3,71.14 U$3.12
N$424
  Top 0.152: IC3.10 47,69.81 44.56,69.81 41.06,73.31 JP9.10
  Bottom 0.305: JP9.10 43.81,70.51 47.3,70.51 U$3.11
N$425
  Top 0.152: JP9.11 39.53,71.94 41.36,71.94 43.95,69.35 47,69.35 IC3.11
  Bottom 0.305: JP9.11 39.68,72.09 41.27,72.09 43.81,69.56 47.3,69.56 U$3.10
N$426
  Top 0.152: JP9.12 43.04,68.74 47,68.74 IC3.12
  Bottom 0.305: JP9.12 42.86,68.92 47.3,68.92 U$3.9
N$427
  Top 0.152: IC3.13 42.43,68.28 41.36,69.35 39.53,69.35 38.47,68.28 JP9.13
  Bottom 0.305: JP9.13 39.68,69.56 41.27,69.56 42.86,67.97 47.3,67.97 U$3.8
N$428
  Top 0.152: IC3.25 47,62.19 47,60.21 40.9,54.11 39.53,54.11 38.47,53.05 JP9.25
N$429
  Top 0.152: IC3.24 47,62.8 46.54,62.8 43.01,59.29 43.01,57.62 41.06,55.63 JP9.24
N$430
  Top 0.152: JP9.23 39.53,56.7 41.06,56.7 42.35,58 42.35,59.06 46.54,63.26 47,63.26 IC3.23
N$431
  Top 0.152: JP9.22 46.54,63.71 47,63.71 IC3.22
N$432
  Top 0.152: IC3.21 47,64.32 46.09,64.32 40.9,59.14 39.38,59.14 38.47,58.23 JP9.21
N$433
  Top 0.152: IC3.20 47,64.78 45.17,64.78 41.06,60.66 JP9.20
  Bottom 0.305: JP9.20 42.54,62.25 47.3,62.25 U$3.1
N$434
  Top 0.152: IC3.19 47,65.24 44.41,65.24 40.9,61.73 39.53,61.73 38.47,60.66 JP9.19
  Bottom 0.305: JP9.19 39.68,61.94 41.27,61.94 42.54,63.2 47.3,63.2 U$3.2
N$435
  Top 0.152: IC3.18 47,65.69 43.49,65.69 41.06,63.26 JP9.18
  Bottom 0.305: JP9.18 41.59,63.84 47.3,63.84 U$3.3
N$436
  Top 0.152: JP9.17 39.53,64.32 41.06,64.32 43.04,66.3 47,66.3 IC3.17
  Bottom 0.305: JP9.17 39.68,64.47 41.27,64.47 41.59,64.79 47.3,64.79 U$3.4
N$437
  Top 0.152: JP9.16 41.97,66.76 47,66.76 IC3.16
  Bottom 0.305: JP9.16 47.3,65.75 U$3.5
N$438
  Top 0.152: IC3.15 47,67.22 39.84,67.22 38.47,65.85 JP9.15
  Bottom 0.305: JP9.15 39.68,67.02 41.27,67.02 41.91,66.38 47.3,66.38 U$3.6
N$439
  Top 0.152: IC3.14 47,67.83 41.51,67.83 41.06,68.28 JP9.14
  Bottom 0.305: JP9.14 41.91,67.33 47.3,67.33 U$3.7
N$440
  Top 0.152: IC3.27 49.44,60.36 49.44,59.9 39.84,50.3 39.84,48.47 40.9,47.41 JP12.1
N$441
  Top 0.152: IC3.28 49.9,60.36 49.9,58.84 41.06,50 JP12.2
N$442
  Top 0.152: IC3.29 50.35,60.36 50.35,58.23 42.43,50.3 42.43,48.47 43.49,47.41 JP12.3
N$443
  Top 0.152: IC3.30 50.96,60.36 50.96,57.46 43.49,50 JP12.4
  Bottom 0.305: JP12.4 48.89,55.27 48.89,60.66 U$3.64
N$444
  Top 0.152: IC3.31 51.42,60.36 51.42,56.7 45.02,50.3 45.02,48.32 45.93,47.41 JP12.5
  Bottom 0.305: JP12.5 44.76,48.6 44.76,50.19 49.53,54.95 49.53,60.66 U$3.63
N$445
  Top 0.152: IC3.32 51.88,60.36 51.88,55.79 46.09,50 JP12.6
  Bottom 0.305: JP12.6 50.48,54.31 50.48,60.66 U$3.62
N$446
  Top 0.152: IC3.33 52.33,60.36 52.33,55.18 47.46,50.3 47.46,48.47 48.52,47.41 JP12.7
  Bottom 0.305: JP12.7 47.3,48.6 47.3,50.19 51.11,54 51.11,60.66 U$3.61
N$447
  Top 0.152: IC3.34 52.94,60.36 52.94,54.26 48.68,50 JP12.8
  Bottom 0.305: JP12.8 52.07,53.36 52.07,60.66 U$3.60
N$448
  Top 0.152: IC3.35 53.4,60.36 53.4,53.65 50.05,50.3 50.05,48.47 51.11,47.41 JP12.9
  Bottom 0.305: JP12.9 49.84,48.6 49.84,50.19 52.7,53.05 52.7,60.66 U$3.59
N$449
  Top 0.152: IC3.36 53.86,60.36 53.86,52.74 51.11,50 JP12.10
  Bottom 0.305: JP12.10 53.65,52.41 53.65,60.66 U$3.58
N$450
  Top 0.152: IC3.37 54.47,60.36 54.47,52.13 52.64,50.3 52.64,48.32 53.55,47.41 JP12.11
  Bottom 0.305: JP12.11 52.38,48.6 52.38,50.19 54.29,52.09 54.29,60.66 U$3.57
N$451
  Top 0.152: IC3.38 54.92,51.22 53.7,50 JP12.12
  Bottom 0.305: JP12.12 55.24,51.46 55.24,60.66 U$3.56
N$452
  Top 0.152: IC3.50 61.02,60.36 61.02,57.77 68.79,50 JP12.24
N$453
  Top 0.152: IC3.49 60.41,60.36 60.41,57.31 67.88,49.84 67.88,48.32 68.79,47.41 JP12.23
N$454
  Top 0.152: IC3.48 59.95,60.36 59.95,56.4 66.35,50 JP12.22
N$455
  Top 0.152: IC3.47 59.5,60.36 59.5,55.63 65.29,49.84 65.29,48.47 66.35,47.41 JP12.21
N$456
  Top 0.152: IC3.46 58.89,60.36 58.89,54.87 63.76,50 JP12.20
N$457
  Top 0.152: IC3.45 58.43,60.36 58.43,54.26 62.7,50 62.7,48.47 63.76,47.41 JP12.19
  Bottom 0.305: JP12.19 62.54,48.6 62.54,50.19 60.96,51.77 60.96,60.66 U$3.49
N$458
  Top 0.152: IC3.44 57.97,60.36 57.97,53.2 61.17,50 JP12.18
  Bottom 0.305: JP12.18 60,51.14 60,60.66 U$3.50
N$459
  Top 0.152: IC3.43 57.52,60.36 57.52,52.59 60.26,49.84 60.26,48.32 61.17,47.41 JP12.17
  Bottom 0.305: JP12.17 60,48.6 60,50.19 59.37,50.82 59.37,60.66 U$3.51
N$460
  Top 0.152: IC3.42 56.91,60.36 56.91,51.83 58.73,50 JP12.16
  Bottom 0.305: JP12.16 58.42,50.19 58.42,60.66 U$3.52
N$461
  Top 0.152: IC3.41 56.45,60.36 56.45,51.06 57.67,49.84 57.67,48.47 58.73,47.41 JP12.15
  Bottom 0.305: JP12.15 57.46,48.6 57.46,60.66 U$3.53
N$462
  Top 0.152: IC3.40 55.99,60.36 55.99,50.15 56.14,50 JP12.14
  Bottom 0.305: JP12.14 56.83,50.51 56.83,60.66 U$3.54
N$463
  Top 0.152: IC3.39 55.38,60.36 55.38,50.61 55.08,50.3 55.08,48.47 56.14,47.41 JP12.13
  Bottom 0.305: JP12.13 54.92,48.6 54.92,50.19 55.88,51.14 55.88,60.66 U$3.55
N$464
  Top 0.152: JP10.14 71.38,68.28 70.32,67.22 68.49,67.22 67.42,68.28 IC3.63 55.42,68.28
  Bottom 0.305: JP10.14 70.16,67.02 68.58,67.02 67.62,67.97 62.54,67.97 U$3.41
N$465
  Top 0.152: IC3.62 66.85,67.78 JP10.15
  Bottom 0.305: JP10.15 67.62,67.02 62.54,67.02 U$3.42
N$466
  Top 0.152: JP10.16 70.44,64.75 68.18,64.75 65.65,67.28 IC3.61 56.42,67.28
  Bottom 0.305: JP10.16 70.16,64.47 68.58,64.47 66.67,66.38 62.54,66.38 U$3.43
N$467
  Top 0.152: JP10.17 65.31,66.78 IC3.60 56.92,66.78
  Bottom 0.305: JP10.17 66.67,65.43 62.54,65.43 U$3.44
N$468
  Top 0.152: IC3.59 62.88,66.18 63.38,66.18 66.81,62.75 66.81,62.25 67.15,61.91 70.14,61.91 JP10.18
  Bottom 0.305: JP10.18 70.16,61.94 68.58,61.94 65.72,64.79 62.54,64.79 U$3.45
N$469
  Top 0.152: JP10.19 67.22,60.66 66.51,61.38 66.51,62.62 63.33,65.8 63.32,65.78 IC3.58 57.92,65.78
  Bottom 0.305: JP10.19 65.72,63.84 62.54,63.84 U$3.46
N$470
  Top 0.152: JP10.20 70.14,59.37 67.02,59.37 66.13,60.26 66.13,62.52 63.36,65.28 IC3.57 58.42,65.28
  Bottom 0.305: JP10.20 70.16,59.4 68.58,59.4 64.77,63.2 62.54,63.2 U$3.47
N$471
  Top 0.152: IC3.56 62.88,64.68 63.38,64.68 65.82,62.24 65.82,59.45 67.14,58.12 JP10.21
  Bottom 0.305: JP10.21 64.77,62.25 62.54,62.25 U$3.48
N$472
  Top 0.152: JP10.22 70.16,56.85 67.47,56.85 65.49,58.84 65.49,62.14 63.34,64.28 IC3.55 59.42,64.28
N$473
  Top 0.152: IC3.54 62.88,63.68 63.34,63.68 64.81,62.21 64.81,58.78 68,55.59 JP10.23
N$474
  Top 0.152: JP10.24 70.3,55.59 69.31,54.59 68,54.59 64.5,58.1 64.5,62.09 63.3,63.28 IC3.53 60.42,63.28
N$475
  Top 0.152: IC3.52 62.85,62.8 63.31,62.8 63.76,62.34 63.76,58.07 68.79,53.05 JP10.25
N$476
  Top 0.152: IC3.51 62.85,62.19 62.85,57.62 68.49,51.98 70.32,51.98 71.38,53.05 JP10.26
N$477
  Top 0.152: IC3.64 62.85,68.74 68.33,68.74 68.79,68.28 JP10.13
  Bottom 0.305: JP10.13 68.58,68.6 62.54,68.6 U$3.40
N$478
  Top 0.152: IC3.65 62.85,69.35 70.01,69.35 71.38,70.72 JP10.12
  Bottom 0.305: JP10.12 70.16,69.56 62.54,69.56 U$3.39
N$479
  Top 0.152: JP10.11 67.88,69.81 62.85,69.81 IC3.66
  Bottom 0.305: JP10.11 68.58,70.51 62.54,70.51 U$3.38
N$480
  Top 0.152: JP10.10 70.32,72.25 68.79,72.25 66.81,70.27 62.85,70.27 IC3.67
  Bottom 0.305: JP10.10 70.16,72.09 68.58,72.09 67.62,71.14 62.54,71.14 U$3.37
N$481
  Top 0.152: IC3.68 62.85,70.88 66.35,70.88 68.79,73.31 JP10.9
  Bottom 0.305: JP10.9 67.62,72.09 62.54,72.09 U$3.36
N$482
  Top 0.152: IC3.69 62.85,71.33 65.44,71.33 68.94,74.84 70.32,74.84 71.38,75.91 JP10.8
  Bottom 0.305: JP10.8 70.16,74.64 68.58,74.64 66.67,72.73 62.54,72.73 U$3.35
N$483
  Top 0.152: IC3.70 62.85,71.79 64.68,71.79 68.79,75.91 JP10.7
  Bottom 0.305: JP10.7 66.67,73.68 62.54,73.68 U$3.34
N$484
  Top 0.152: IC3.71 62.85,72.25 63.76,72.25 68.94,77.43 70.47,77.43 71.38,78.34 JP10.6
  Bottom 0.305: JP10.6 70.16,77.17 68.58,77.17 65.72,74.32 62.54,74.32 U$3.33
N$485
  Top 0.152: JP10.5 63.31,72.86 62.85,72.86 IC3.72
N$486
  Top 0.152: JP10.4 70.32,79.87 68.79,79.87 67.88,78.95 67.88,77.89 63.31,73.31 62.85,73.31 IC3.73
N$487
  Top 0.152: IC3.74 62.85,73.77 63.31,73.77 67.57,78.04 67.57,79.72 68.79,80.93 JP10.3
N$488
  Top 0.152: IC3.75 62.85,74.38 62.85,76.36 68.94,82.46 70.32,82.46 71.38,83.53 JP10.2
N$489
  Top 0.152: IC3.100 48.83,76.21 48.83,78.8 41.06,86.57 JP11.1
N$490
  Top 0.152: IC3.99 49.44,76.21 49.44,79.26 41.97,86.72 41.97,88.25 41.06,89.16 JP11.2
N$491
  Top 0.152: IC3.98 49.9,76.21 49.9,80.17 43.49,86.57 JP11.3
N$492
  Top 0.152: IC3.97 50.35,76.21 50.35,80.93 44.56,86.72 44.56,88.1 43.49,89.16 JP11.4
N$493
  Top 0.152: IC3.96 50.96,76.21 50.96,81.7 46.09,86.57 JP11.5
  Bottom 0.305: JP11.5 48.89,83.84 48.89,75.91 U$3.17
N$494
  Top 0.152: IC3.95 51.42,76.21 51.42,82.31 47.15,86.57 47.15,88.1 46.09,89.16 JP11.6
  Bottom 0.305: JP11.6 47.3,87.97 47.3,86.38 49.53,84.16 49.53,75.91 U$3.18
N$495
  Top 0.152: IC3.94 51.88,76.21 51.88,83.37 48.68,86.57 JP11.7
  Bottom 0.305: JP11.7 50.48,84.8 50.48,75.91 U$3.19
N$496
  Top 0.152: IC3.93 52.33,76.21 52.33,83.98 49.59,86.72 49.59,88.25 48.68,89.16 JP11.8
  Bottom 0.305: JP11.8 49.84,87.97 49.84,86.38 51.11,85.11 51.11,75.91 U$3.20
N$497
  Top 0.152: IC3.92 52.94,76.21 52.94,84.74 51.11,86.57 JP11.9
  Bottom 0.305: JP11.9 52.07,85.75 52.07,75.91 U$3.21
N$498
  Top 0.152: IC3.91 53.4,76.21 53.4,85.51 52.18,86.72 52.18,88.1 51.11,89.16 JP11.10
  Bottom 0.305: JP11.10 52.38,87.97 52.38,86.38 52.7,86.06 52.7,75.91 U$3.22
N$499
  Top 0.152: IC3.90 53.86,76.21 53.86,86.42 53.7,86.57 JP11.11
  Bottom 0.305: JP11.11 53.65,75.91 U$3.23
N$500
  Top 0.152: IC3.89 54.47,76.21 54.47,85.96 54.77,86.27 54.77,88.1 53.7,89.16 JP11.12
  Bottom 0.305: JP11.12 54.92,87.97 54.92,86.38 54.61,86.06 54.61,75.91 U$3.24
N$501
  Top 0.152: IC3.77 60.41,76.21 60.41,76.67 70.01,86.27 70.01,88.1 68.94,89.16 JP11.24
N$502
  Top 0.152: IC3.78 59.95,76.21 59.95,77.73 68.79,86.57 JP11.23
N$503
  Top 0.152: IC3.79 59.5,76.21 59.5,78.34 67.42,86.27 67.42,88.1 66.35,89.16 JP11.22
N$504
  Top 0.152: IC3.80 58.89,76.21 58.89,79.11 66.35,86.57 JP11.21
N$505
  Top 0.152: IC3.81 58.43,76.21 58.43,79.87 64.83,86.27 64.83,88.25 63.92,89.16 JP11.20
  Bottom 0.305: JP11.20 65.08,87.97 65.08,86.38 60.96,82.25 60.96,75.91 U$3.32
N$506
  Top 0.152: IC3.82 57.97,76.21 57.97,80.78 63.76,86.57 JP11.19
  Bottom 0.305: JP11.19 60,82.89 60,75.91 U$3.31
N$507
  Top 0.152: IC3.83 57.52,76.21 57.52,81.39 62.39,86.27 62.39,88.1 61.33,89.16 JP11.18
  Bottom 0.305: JP11.18 62.54,87.97 62.54,86.38 59.37,83.21 59.37,75.91 U$3.30
N$508
  Top 0.152: IC3.84 56.91,76.21 56.91,82.31 61.17,86.57 JP11.17
  Bottom 0.305: JP11.17 58.42,83.84 58.42,75.91 U$3.29
N$509
  Top 0.152: IC3.85 56.45,76.21 56.45,82.92 59.8,86.27 59.8,88.1 58.73,89.16 JP11.16
  Bottom 0.305: JP11.16 60,87.97 60,86.38 57.78,84.16 57.78,75.91 U$3.28
N$510
  Top 0.152: IC3.86 55.99,76.21 55.99,83.83 58.73,86.57 JP11.15
  Bottom 0.305: JP11.15 56.83,84.8 56.83,75.91 U$3.27
N$511
  Top 0.152: IC3.87 55.38,76.21 55.38,84.44 57.21,86.27 57.21,88.25 56.3,89.16 JP11.14
  Bottom 0.305: JP11.14 57.46,87.97 57.46,86.38 56.19,85.11 56.19,75.91 U$3.26
N$512
  Top 0.152: IC3.88 54.92,85.35 56.14,86.57 JP11.13
  Bottom 0.305: JP11.13 55.24,85.75 55.24,75.91 U$3.25
N$513
  Top 0.152: IC3.76 61.02,76.21 61.48,76.21 68.79,83.53 JP10.1
N$514
  Top 0.152: IC3.26 48.83,60.36 48.37,60.36 41.06,53.05 JP9.26
N$515
  Top 0.152: 48.92,60.78 48.92,70.28
N$516
  Top 0.152: 49.42,70.28 49.42,60.78
N$517
  Top 0.152: 49.92,60.78 49.92,70.28
N$518
  Top 0.152: 50.42,70.28 50.42,60.78
N$519
  Top 0.152: 50.92,70.28 50.92,60.78
N$520
  Top 0.152: 51.42,60.78 51.42,70.28
N$521
  Top 0.152: 51.92,70.28 51.92,60.78
N$522
  Top 0.152: 52.42,60.78 52.42,70.28
N$523
  Top 0.152: 62.92,74.28 52.92,74.28
N$524
  Top 0.152: 52.92,73.78 62.42,73.78
N$525
  Top 0.152: 62.42,73.28 52.92,73.28
N$526
  Top 0.152: 52.92,72.78 62.42,72.78
N$527
  Top 0.152: 62.42,72.28 52.92,72.28
N$528
  Top 0.152: 52.92,71.78 62.42,71.78
N$529
  Top 0.152: 62.42,71.28 52.92,71.28
N$530
  Top 0.152: 52.92,70.78 62.42,70.78
N$531
  Top 0.152: 52.92,69.78 52.92,60.28
N$532
  Top 0.152: 53.42,60.28 53.42,69.28
N$533
  Top 0.152: 53.92,68.78 53.92,60.78
N$534
  Top 0.152: 54.42,60.78 54.42,68.28
N$535
  Top 0.152: 54.92,67.78 54.92,60.78
N$536
  Top 0.152: 55.42,60.78 55.42,67.28
N$537
  Top 0.152: 55.92,66.78 55.92,60.78
N$538
  Top 0.152: 56.42,60.78 56.42,66.28
N$539
  Top 0.152: 56.92,65.78 56.92,60.78
N$540
  Top 0.152: 57.42,60.78 57.42,65.28
N$541
  Top 0.152: 57.92,64.78 57.92,60.28
N$542
  Top 0.152: 58.42,60.28 58.42,64.28
N$543
  Top 0.152: 58.92,63.78 58.92,60.78
N$544
  Top 0.152: 59.42,60.78 59.42,63.28
N$545
  Top 0.152: 59.92,62.78 59.92,60.78
N$546
  Top 0.152: 60.42,60.78 60.42,62.28
N$547
  Top 0.152: 60.92,60.28 60.92,61.78
N$548
  Top 0.152: 62.42,70.28 53.42,70.28
N$549
  Top 0.152: 53.92,69.78 62.92,69.78
N$550
  Top 0.152: 62.92,69.28 54.42,69.28
N$551
  Top 0.152: 54.92,68.78 62.92,68.78
N$552
  Top 0.152: 55.92,67.78 62.42,67.78
N$553
  Top 0.152: 62.92,66.28 57.42,66.28
N$554
  Top 0.152: 62.92,64.78 58.92,64.78
N$555
  Top 0.152: 62.92,63.78 59.92,63.78
N$556
  Top 0.152: 62.92,62.78 60.92,62.78
N$557
  Top 0.152: 61.42,62.28 62.92,62.28
N$558
  Top 0.152: 46.92,74.28 48.42,74.28
N$559
  Top 0.152: 46.92,73.78 48.42,73.78
N$560
  Top 0.152: 48.42,73.28 46.92,73.28
N$561
  Top 0.152: 46.92,72.78 48.42,72.78
N$562
  Top 0.152: 48.42,72.28 46.92,72.28
N$563
  Top 0.152: 46.92,71.78 48.42,71.78
N$564
  Top 0.152: 48.42,71.28 46.92,71.28
N$565
  Top 0.152: 46.92,70.78 48.42,70.78
N$566
  Top 0.152: 52.42,74.78 52.42,76.28
N$567
  Top 0.152: 51.92,74.78 51.92,76.28
N$568
  Top 0.152: 51.42,76.28 51.42,74.78
N$569
  Top 0.152: 50.92,74.78 50.92,76.28
N$570
  Top 0.152: 50.42,76.28 50.42,74.78
N$571
  Top 0.152: 49.92,74.78 49.92,76.28
N$572
  Top 0.152: 49.42,76.28 49.42,74.78
N$573
  Top 0.152: 48.92,74.78 48.92,76.28
N$574
  Bottom 0.305: 48.92,60.69 48.92,67.89
N$575
  Bottom 0.305: 49.72,67.89 49.72,60.69
N$576
  Bottom 0.305: 50.52,61.09 50.52,67.89
N$577
  Bottom 0.305: 51.32,67.89 51.32,60.69
N$578
  Bottom 0.305: 52.12,60.69 52.12,67.89
N$579
  Bottom 0.305: 52.92,67.89 52.92,60.69
N$580
  Bottom 0.305: 53.72,61.09 53.72,67.89
N$581
  Bottom 0.305: 54.52,67.89 54.52,60.69
N$582
  Bottom 0.305: 55.32,67.08 55.32,60.69
N$583
  Bottom 0.305: 56.12,60.69 56.12,66.28
N$584
  Bottom 0.305: 56.92,65.48 56.92,60.69
N$585
  Bottom 0.305: 57.72,61.09 57.72,64.69
N$586
  Bottom 0.305: 58.52,63.88 58.52,60.69
N$587
  Bottom 0.305: 59.32,60.69 59.32,63.09
N$588
  Bottom 0.305: 60.12,62.28 60.12,61.09
N$589
  Bottom 0.305: 60.92,61.09 60.92,61.48
N$590
  Bottom 0.305: 62.52,74.28 55.32,74.28
N$591
  Bottom 0.305: 55.32,73.48 62.52,73.48
N$592
  Bottom 0.305: 62.52,72.69 55.32,72.69
N$593
  Bottom 0.305: 55.32,71.89 62.52,71.89
N$594
  Bottom 0.305: 62.52,71.08 55.32,71.08
N$595
  Bottom 0.305: 55.32,70.28 62.52,70.28
N$596
  Bottom 0.305: 62.52,69.48 55.32,69.48
N$597
  Bottom 0.305: 55.32,68.69 62.52,68.69
N$598
  Bottom 0.305: 56.12,67.89 62.52,67.89
N$599
  Bottom 0.305: 56.92,67.08 62.52,67.08
N$600
  Bottom 0.305: 57.72,66.28 62.12,66.28
N$601
  Bottom 0.305: 62.52,65.48 58.52,65.48
N$602
  Bottom 0.305: 59.32,64.69 62.52,64.69
N$603
  Bottom 0.305: 62.52,63.88 60.12,63.88
N$604
  Bottom 0.305: 60.92,63.09 62.52,63.09
N$605
  Bottom 0.305: 62.52,62.28 61.72,62.28
N$606
  Bottom 0.305: 47.32,68.69 48.12,68.69
N$607
  Bottom 0.305: 47.32,69.48 48.12,69.48
N$608
  Bottom 0.305: 47.32,70.28 48.12,70.28
N$609
  Bottom 0.305: 47.32,71.08 48.12,71.08
N$610
  Bottom 0.305: 47.32,71.89 48.12,71.89
N$611
  Bottom 0.305: 47.32,72.69 48.12,72.69
N$612
  Bottom 0.305: 47.32,73.48 48.12,73.48
N$613
  Bottom 0.305: 47.32,74.28 48.12,74.28
N$614
  Bottom 0.305: 48.92,75.89 48.92,75.08
N$615
  Bottom 0.305: 49.72,75.89 49.72,75.08
N$616
  Bottom 0.305: 50.52,75.89 50.52,75.08
N$617
  Bottom 0.305: 51.32,75.89 51.32,75.08
N$618
  Bottom 0.305: 52.12,75.48 52.12,75.08
N$619
  Bottom 0.305: 52.92,75.08 52.92,75.48
N$620
  Bottom 0.305: 53.72,75.89 53.72,75.08
N$621
  Bottom 0.305: 54.52,75.08 54.52,75.89
N$622
  Top 0.152: IC4.1 47.02,29.63 47.02,34.2 41.39,39.84 39.56,39.84 38.49,38.77 JP13.1
N$623
  Top 0.152: IC4.2 47.02,29.02 46.57,29.02 43.52,32.06 43.52,36.33 41.08,38.77 JP13.2
N$624
  Top 0.152: IC4.3 47.02,28.56 46.57,28.56 43.22,31.91 43.22,35.42 41.39,37.25 39.41,37.25 38.49,36.33 JP13.3
N$625
  Top 0.152: IC4.4 47.02,28.1 46.57,28.1 42.91,31.76 42.91,34.35 41.08,36.18 JP13.4
N$626
  Top 0.152: JP13.5 39.56,34.81 41.39,34.81 42.6,33.59 42.6,31.45 46.57,27.49 47.02,27.49 IC4.5
  Bottom 0.305: JP13.5 39.71,34.96 41.3,34.96 46.7,29.56 47.33,29.56 U$4.16
N$627
  Top 0.152: JP13.6 42.3,32.37 42.3,31.3 46.57,27.04 47.02,27.04 IC4.6
  Bottom 0.305: JP13.6 45.74,28.93 47.33,28.93 U$4.15
N$628
  Top 0.152: IC4.7 47.02,26.58 46.57,26.58 42,31.15 42,31.61 41.39,32.22 39.56,32.22 38.49,31.15 JP13.7
  Bottom 0.305: JP13.7 39.71,32.42 41.3,32.42 45.74,27.98 47.33,27.98 U$4.14
N$629
  Top 0.152: IC4.8 47.02,26.12 46.11,26.12 41.08,31.15 JP13.8
  Bottom 0.305: JP13.8 44.79,27.34 47.33,27.34 U$4.13
N$630
  Top 0.152: IC4.9 47.02,25.51 45.5,25.51 41.39,29.63 39.41,29.63 38.49,28.71 JP13.9
  Bottom 0.305: JP13.9 39.71,29.88 41.3,29.88 44.79,26.39 47.33,26.39 U$4.12
N$631
  Top 0.152: IC4.10 47.02,25.05 44.59,25.05 41.08,28.56 JP13.10
  Bottom 0.305: JP13.10 43.84,25.75 47.33,25.75 U$4.11
N$632
  Top 0.152: JP13.11 39.56,27.19 41.39,27.19 43.98,24.6 47.02,24.6 IC4.11
  Bottom 0.305: JP13.11 39.71,27.34 41.3,27.34 43.84,24.8 47.33,24.8 U$4.10
N$633
  Top 0.152: JP13.12 43.06,23.99 47.02,23.99 IC4.12
  Bottom 0.305: JP13.12 42.88,24.16 47.33,24.16 U$4.9
N$634
  Top 0.152: IC4.13 42.45,23.53 41.39,24.6 39.56,24.6 38.49,23.53 JP13.13
  Bottom 0.305: JP13.13 39.71,24.8 41.3,24.8 42.88,23.21 47.33,23.21 U$4.8
N$635
  Top 0.152: IC4.25 47.02,17.43 47.02,15.45 40.93,9.36 39.56,9.36 38.49,8.29 JP13.25
N$636
  Top 0.152: IC4.24 47.02,18.04 46.57,18.04 43.04,14.54 43.04,12.86 41.08,10.88 JP13.24
N$637
  Top 0.152: JP13.23 39.56,11.95 41.08,11.95 42.38,13.24 42.38,14.31 46.57,18.5 47.02,18.5 IC4.23
N$638
  Top 0.152: JP13.22 46.57,18.96 47.02,18.96 IC4.22
N$639
  Top 0.152: IC4.21 47.02,19.57 46.11,19.57 40.93,14.39 39.41,14.39 38.49,13.47 JP13.21
N$640
  Top 0.152: IC4.20 47.02,20.02 45.2,20.02 41.08,15.91 JP13.20
  Bottom 0.305: JP13.20 42.57,17.5 47.33,17.5 U$4.1
N$641
  Top 0.152: IC4.19 47.02,20.48 44.43,20.48 40.93,16.98 39.56,16.98 38.49,15.91 JP13.19
  Bottom 0.305: JP13.19 39.71,17.18 41.3,17.18 42.57,18.45 47.33,18.45 U$4.2
N$642
  Top 0.152: IC4.18 47.02,20.94 43.52,20.94 41.08,18.5 JP13.18
  Bottom 0.305: JP13.18 41.62,19.09 47.33,19.09 U$4.3
N$643
  Top 0.152: JP13.17 39.56,19.57 41.08,19.57 43.06,21.55 47.02,21.55 IC4.17
  Bottom 0.305: JP13.17 39.71,19.72 41.3,19.72 41.62,20.04 47.33,20.04 U$4.4
N$644
  Top 0.152: JP13.16 42,22.01 47.02,22.01 IC4.16
  Bottom 0.305: JP13.16 47.33,20.99 U$4.5
N$645
  Top 0.152: IC4.15 47.02,22.46 39.86,22.46 38.49,21.09 JP13.15
  Bottom 0.305: JP13.15 39.71,22.26 41.3,22.26 41.93,21.62 47.33,21.62 U$4.6
N$646
  Top 0.152: IC4.14 47.02,23.07 41.54,23.07 41.08,23.53 JP13.14
  Bottom 0.305: JP13.14 41.93,22.58 47.33,22.58 U$4.7
N$647
  Top 0.152: IC4.27 49.46,15.61 49.46,15.15 39.86,5.55 39.86,3.72 40.93,2.65 JP16.1
N$648
  Top 0.152: IC4.28 49.92,15.61 49.92,14.08 41.08,5.24 JP16.2
N$649
  Top 0.152: IC4.29 50.38,15.61 50.38,13.47 42.45,5.55 42.45,3.72 43.52,2.65 JP16.3
N$650
  Top 0.152: IC4.30 50.99,15.61 50.99,12.71 43.52,5.24 JP16.4
  Bottom 0.305: JP16.4 48.92,10.51 48.92,15.91 U$4.64
N$651
  Top 0.152: IC4.31 51.44,15.61 51.44,11.95 45.04,5.55 45.04,3.56 45.96,2.65 JP16.5
  Bottom 0.305: JP16.5 44.79,3.85 44.79,5.43 49.55,10.2 49.55,15.91 U$4.63
N$652
  Top 0.152: IC4.32 51.9,15.61 51.9,11.03 46.11,5.24 JP16.6
  Bottom 0.305: JP16.6 50.51,9.56 50.51,15.91 U$4.62
N$653
  Top 0.152: IC4.33 52.36,15.61 52.36,10.42 47.48,5.55 47.48,3.72 48.55,2.65 JP16.7
  Bottom 0.305: JP16.7 47.33,3.85 47.33,5.43 51.14,9.24 51.14,15.91 U$4.61
N$654
  Top 0.152: IC4.34 52.97,15.61 52.97,9.51 48.7,5.24 JP16.8
  Bottom 0.305: JP16.8 52.09,8.61 52.09,15.91 U$4.60
N$655
  Top 0.152: IC4.35 53.43,15.61 53.43,8.9 50.07,5.55 50.07,3.72 51.14,2.65 JP16.9
  Bottom 0.305: JP16.9 49.87,3.85 49.87,5.43 52.73,8.29 52.73,15.91 U$4.59
N$656
  Top 0.152: IC4.36 53.88,15.61 53.88,7.99 51.14,5.24 JP16.10
  Bottom 0.305: JP16.10 53.68,7.66 53.68,15.91 U$4.58
N$657
  Top 0.152: IC4.37 54.49,15.61 54.49,7.38 52.66,5.55 52.66,3.56 53.58,2.65 JP16.11
  Bottom 0.305: JP16.11 52.41,3.85 52.41,5.43 54.31,7.34 54.31,15.91 U$4.57
N$658
  Top 0.152: IC4.38 54.95,6.46 53.73,5.24 JP16.12
  Bottom 0.305: JP16.12 55.27,6.7 55.27,15.91 U$4.56
N$659
  Top 0.152: IC4.50 61.05,15.61 61.05,13.01 68.82,5.24 JP16.24
N$660
  Top 0.152: IC4.49 60.44,15.61 60.44,12.56 67.9,5.09 67.9,3.56 68.82,2.65 JP16.23
N$661
  Top 0.152: IC4.48 59.98,15.61 59.98,11.64 66.38,5.24 JP16.22
N$662
  Top 0.152: IC4.47 59.52,15.61 59.52,10.88 65.31,5.09 65.31,3.72 66.38,2.65 JP16.21
N$663
  Top 0.152: IC4.46 58.91,15.61 58.91,10.12 63.79,5.24 JP16.20
N$664
  Top 0.152: IC4.45 58.45,15.61 58.45,9.51 62.72,5.24 62.72,3.72 63.79,2.65 JP16.19
  Bottom 0.305: JP16.19 62.57,3.85 62.57,5.43 60.98,7.02 60.98,15.91 U$4.49
N$665
  Top 0.152: IC4.44 58,15.61 58,8.44 61.2,5.24 JP16.18
  Bottom 0.305: JP16.18 60.03,6.38 60.03,15.91 U$4.50
N$666
  Top 0.152: IC4.43 57.54,15.61 57.54,7.83 60.28,5.09 60.28,3.56 61.2,2.65 JP16.17
  Bottom 0.305: JP16.17 60.03,3.85 60.03,5.43 59.4,6.07 59.4,15.91 U$4.51
N$667
  Top 0.152: IC4.42 56.93,15.61 56.93,7.07 58.76,5.24 JP16.16
  Bottom 0.305: JP16.16 58.44,5.43 58.44,15.91 U$4.52
N$668
  Top 0.152: IC4.41 56.47,15.61 56.47,6.31 57.69,5.09 57.69,3.72 58.76,2.65 JP16.15
  Bottom 0.305: JP16.15 57.49,3.85 57.49,15.91 U$4.53
N$669
  Top 0.152: IC4.40 56.02,15.61 56.02,5.39 56.17,5.24 JP16.14
  Bottom 0.305: JP16.14 56.85,5.75 56.85,15.91 U$4.54
N$670
  Top 0.152: IC4.39 55.41,15.61 55.41,5.85 55.1,5.55 55.1,3.72 56.17,2.65 JP16.13
  Bottom 0.305: JP16.13 54.95,3.85 54.95,5.43 55.9,6.38 55.9,15.91 U$4.55
N$671
  Top 0.152: JP14.14 71.41,23.53 70.34,22.46 68.51,22.46 67.45,23.53 IC4.63 55.45,23.53
  Bottom 0.305: JP14.14 70.19,22.26 68.6,22.26 67.65,23.21 62.57,23.21 U$4.41
N$672
  Top 0.152: IC4.62 66.88,23.03 JP14.15
  Bottom 0.305: JP14.15 67.65,22.26 62.57,22.26 U$4.42
N$673
  Top 0.152: JP14.16 70.47,20 68.21,20 65.68,22.53 IC4.61 56.45,22.53
  Bottom 0.305: JP14.16 70.19,19.72 68.6,19.72 66.7,21.62 62.57,21.62 U$4.43
N$674
  Top 0.152: JP14.17 65.34,22.03 IC4.60 56.95,22.03
  Bottom 0.305: JP14.17 66.7,20.67 62.57,20.67 U$4.44
N$675
  Top 0.152: IC4.59 62.9,21.43 63.4,21.43 66.84,17.99 66.84,17.49 67.17,17.15 70.16,17.15 JP14.18
  Bottom 0.305: JP14.18 70.19,17.18 68.6,17.18 65.75,20.04 62.57,20.04 U$4.45
N$676
  Top 0.152: JP14.19 67.24,15.91 66.53,16.62 66.53,17.87 63.36,21.04 63.35,21.03 IC4.58 57.95,21.03
  Bottom 0.305: JP14.19 65.75,19.09 62.57,19.09 U$4.46
N$677
  Top 0.152: JP14.20 70.16,14.61 67.04,14.61 66.15,15.5 66.15,17.76 63.38,20.53 IC4.57 58.45,20.53
  Bottom 0.305: JP14.20 70.19,14.64 68.6,14.64 64.79,18.45 62.57,18.45 U$4.47
N$678
  Top 0.152: IC4.56 62.9,19.93 63.4,19.93 65.85,17.48 65.85,14.69 67.17,13.37 JP14.21
  Bottom 0.305: JP14.21 64.79,17.5 62.57,17.5 U$4.48
N$679
  Top 0.152: JP14.22 70.19,12.1 67.5,12.1 65.52,14.08 65.52,17.38 63.37,19.53 IC4.55 59.45,19.53
N$680
  Top 0.152: IC4.54 62.9,18.93 63.36,18.93 64.83,17.46 64.83,14.03 68.03,10.83 JP14.23
N$681
  Top 0.152: JP14.24 70.32,10.83 69.33,9.84 68.03,9.84 64.53,13.34 64.53,17.33 63.33,18.53 IC4.53 60.45,18.53
N$682
  Top 0.152: IC4.52 62.87,18.04 63.33,18.04 63.79,17.59 63.79,13.32 68.82,8.29 JP14.25
N$683
  Top 0.152: IC4.51 62.87,17.43 62.87,12.86 68.51,7.22 70.34,7.22 71.41,8.29 JP14.26
N$684
  Top 0.152: IC4.64 62.87,23.99 68.36,23.99 68.82,23.53 JP14.13
  Bottom 0.305: JP14.13 68.6,23.85 62.57,23.85 U$4.40
N$685
  Top 0.152: IC4.65 62.87,24.6 70.04,24.6 71.41,25.97 JP14.12
  Bottom 0.305: JP14.12 70.19,24.8 62.57,24.8 U$4.39
N$686
  Top 0.152: JP14.11 67.9,25.05 62.87,25.05 IC4.66
  Bottom 0.305: JP14.11 68.6,25.75 62.57,25.75 U$4.38
N$687
  Top 0.152: JP14.10 70.34,27.49 68.82,27.49 66.84,25.51 62.87,25.51 IC4.67
  Bottom 0.305: JP14.10 70.19,27.34 68.6,27.34 67.65,26.39 62.57,26.39 U$4.37
N$688
  Top 0.152: IC4.68 62.87,26.12 66.38,26.12 68.82,28.56 JP14.9
  Bottom 0.305: JP14.9 67.65,27.34 62.57,27.34 U$4.36
N$689
  Top 0.152: IC4.69 62.87,26.58 65.47,26.58 68.97,30.08 70.34,30.08 71.41,31.15 JP14.8
  Bottom 0.305: JP14.8 70.19,29.88 68.6,29.88 66.7,27.98 62.57,27.98 U$4.35
N$690
  Top 0.152: IC4.70 62.87,27.04 64.7,27.04 68.82,31.15 JP14.7
  Bottom 0.305: JP14.7 66.7,28.93 62.57,28.93 U$4.34
N$691
  Top 0.152: IC4.71 62.87,27.49 63.79,27.49 68.97,32.67 70.49,32.67 71.41,33.59 JP14.6
  Bottom 0.305: JP14.6 70.19,32.42 68.6,32.42 65.75,29.56 62.57,29.56 U$4.33
N$692
  Top 0.152: JP14.5 63.33,28.1 62.87,28.1 IC4.72
N$693
  Top 0.152: JP14.4 70.34,35.11 68.82,35.11 67.9,34.2 67.9,33.13 63.33,28.56 62.87,28.56 IC4.73
N$694
  Top 0.152: IC4.74 62.87,29.02 63.33,29.02 67.6,33.28 67.6,34.96 68.82,36.18 JP14.3
N$695
  Top 0.152: IC4.75 62.87,29.63 62.87,31.61 68.97,37.7 70.34,37.7 71.41,38.77 JP14.2
N$696
  Top 0.152: IC4.100 48.85,31.45 48.85,34.05 41.08,41.82 JP15.1
N$697
  Top 0.152: IC4.99 49.46,31.45 49.46,34.5 42,41.97 42,43.49 41.08,44.41 JP15.2
N$698
  Top 0.152: IC4.98 49.92,31.45 49.92,35.42 43.52,41.82 JP15.3
N$699
  Top 0.152: IC4.97 50.38,31.45 50.38,36.18 44.59,41.97 44.59,43.34 43.52,44.41 JP15.4
N$700
  Top 0.152: IC4.96 50.99,31.45 50.99,36.94 46.11,41.82 JP15.5
  Bottom 0.305: JP15.5 48.92,39.09 48.92,31.15 U$4.17
N$701
  Top 0.152: IC4.95 51.44,31.45 51.44,37.55 47.18,41.82 47.18,43.34 46.11,44.41 JP15.6
  Bottom 0.305: JP15.6 47.33,43.22 47.33,41.63 49.55,39.41 49.55,31.15 U$4.18
N$702
  Top 0.152: IC4.94 51.9,31.45 51.9,38.62 48.7,41.82 JP15.7